# Altium project MiniRobot.PrjPcb
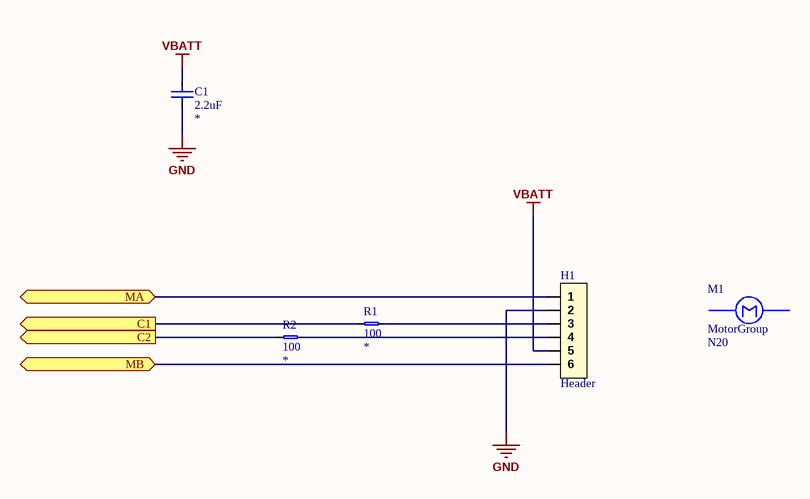
[diagram p0: MR_Motor.SchDoc]
5 sheets, 29 parts. Net scope: flat (ports and power ports of the same name join across sheets).
Board file: MiniRobot.PcbDoc
Sheets:
  MR_Motor.SchDoc
  MR_Motor_Control.SchDoc
  MR_Power.SchDoc
  MR_RangeSensor.SchDoc
  MR_UartConnector.SchDoc

## Sheet MR_Motor.SchDoc
size A4; CompanyName: BeeIonic; SheetNumber: 2; SheetTotal: 7

### Parts
(Parts that share a designator on the sheet are numbered #1, #2 ... from top to bottom, then left to right.)
C1  value 2.2uF  [0603_CAP_LD]  (hidden comment: CerCap)
H1  Header  [HEADER_1X6_PICOBLADE_653106124022]
M1#1  MotorGroup  Reference: N20  [MotorGroup]
R1  value 100  [0603_RES_LD]  (hidden comment: Resistor)
R2  value 100  [0603_RES_LD]  (hidden comment: Resistor)

### Ports
C1 (out), C2 (out), MA (bidir), MB (bidir)

### Nets
GND: C1.1 H1.2
VBATT: C1.2 H1.5
NetH1_1: H1.1 ; port MA
NetH1_3: H1.3 R1.2
NetH1_4: H1.4 R2.2
NetH1_6: H1.6 ; port MB
NetR1_1: R1.1 ; port C1
NetR2_1: R2.1 ; port C2

### Notes on the sheet
- Project :
- Title :
- Sheet:
- of
- Creation Date :
- Designer :
- Modified Date :

### Library data of the parts
C1 = CerCap: Ceramic Capacitor; Type: *; Voltage/Power: *; Package: *
H1 = Header_6x1: Header 6x1 Pins
M1#1 = Motor
R1 R2 = Resistor: Precision: *; Package: *

## Sheet MR_Motor_Control.SchDoc
size A4; CompanyName: BeeIonic; SheetNumber: 3; SheetTotal: 7
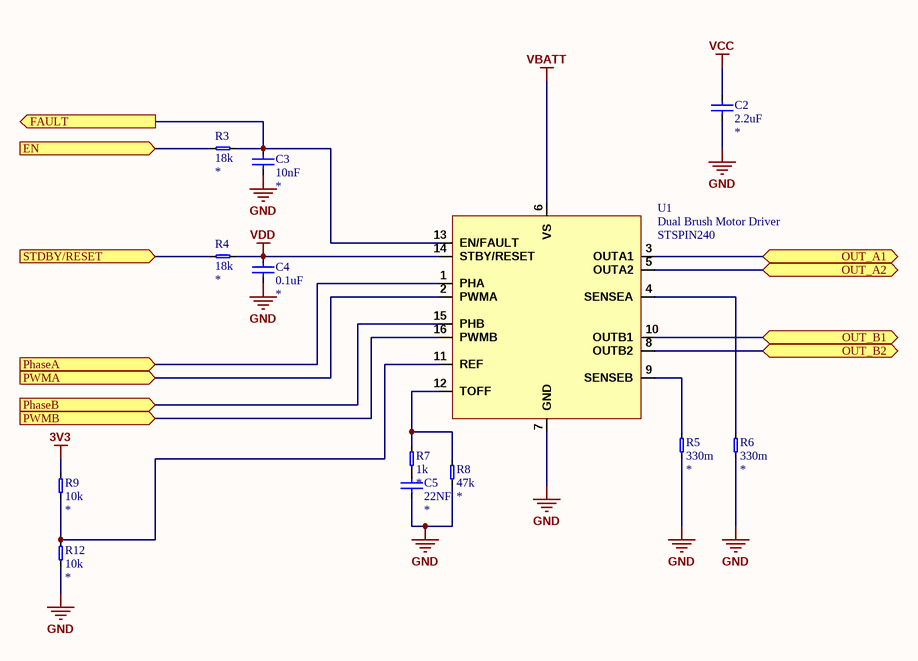
[diagram p1: MR_Motor_Control.SchDoc]

### Parts
C2  value 2.2uF  [0603_CAP_LD]  (hidden comment: CerCap)
C3  value 10nF  [0603_CAP_LD]  (hidden comment: CerCap)
C4  value 0.1uF  [0603_CAP_LD]  (hidden comment: CerCap)
C5  value 22NF  [0603_CAP_LD]  (hidden comment: CerCap)
R3  value 18k  [0603_RES_LD]  (hidden comment: Resistor)
R4  value 18k  [0603_RES_LD]  (hidden comment: Resistor)
R5  value 330m  [2512_RES_LD]  (hidden comment: Resistor)
R6  value 330m  [2512_RES_LD]  (hidden comment: Resistor)
R7  value 1k  [0603_RES_LD]  (hidden comment: Resistor)
R8  value 47k  [0603_RES_LD]  (hidden comment: Resistor)
R9  value 10k  [0603_RES_LD]  (hidden comment: Resistor)
R12  value 10k  [0603_RES_LD]  (hidden comment: Resistor)
U1  Dual Brush Motor Driver  [QFN-STSPIN240]

### Ports
EN (in), FAULT (out), OUT_A1 (bidir), OUT_A2 (bidir), OUT_B1 (bidir), OUT_B2 (bidir), PhaseA (in), PhaseB (in), PWMA (in), PWMB (in), STDBY/RESET (in)

### Nets
3V3: R9.2
GND: C2.1 C3.2 C4.2 C5.1 R5.1 R6.1 R8.1 R12.1 U1.7(GND)
VBATT: U1.6(VS)
VCC: C2.2
VDD: C4.1 R4.1 U1.14(STBY/RESET)
NetC3_1: C3.1 R3.2 U1.13(EN/FAULT) ; port FAULT
NetC5_2: C5.2 R7.1
NetR3_1: R3.1 ; port EN
NetR4_2: R4.2 ; port STDBY/RESET
NetR5_2: R5.2 U1.9(SENSEB)
NetR6_2: R6.2 U1.4(SENSEA)
NetR7_2: R7.2 R8.2 U1.12(TOFF)
NetR9_1: R9.1 R12.2 U1.11(REF)
NetU1_1: U1.1(PHA) ; port PhaseA
NetU1_2: U1.2(PWMA) ; port PWMA
NetU1_3: U1.3(OUTA1) ; port OUT_A1
NetU1_5: U1.5(OUTA2) ; port OUT_A2
NetU1_8: U1.8(OUTB2) ; port OUT_B2
NetU1_10: U1.10(OUTB1) ; port OUT_B1
NetU1_15: U1.15(PHB) ; port PhaseB
NetU1_16: U1.16(PWMB) ; port PWMB

### Notes on the sheet
- Project :
- Title :
- Sheet:
- of
- Creation Date :
- Designer :
- Modified Date :

### Library data of the parts
C2-C5 = CerCap: Ceramic Capacitor; Type: *; Voltage/Power: *; Package: *
U1 = STSPIN240: ST Dual Motor Driver; Reference: STSPIN240
R3-R9 R12 = Resistor: Precision: *; Package: *

## Sheet MR_Power.SchDoc
size A4; CompanyName: BeeIonic; SheetNumber: 5; SheetTotal: 7
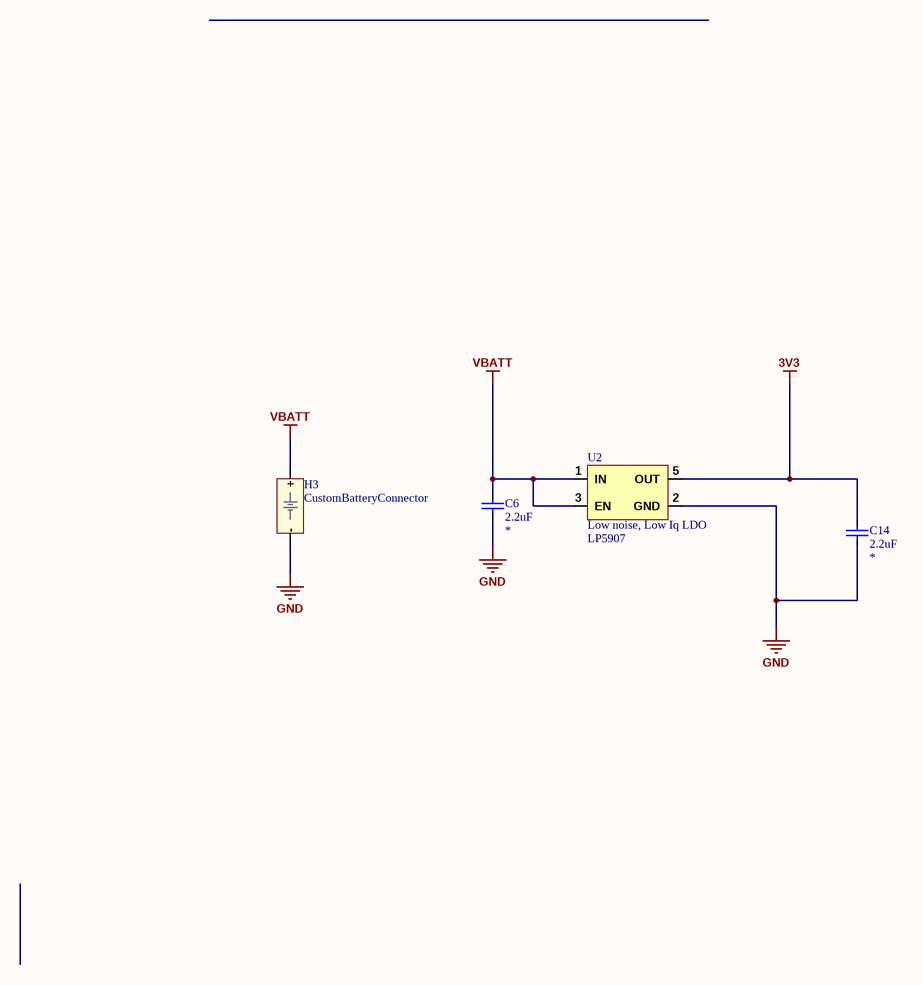
[diagram p2: MR_Power.SchDoc]

### Parts
C6  value 2.2uF  [0603_CAP_LD]  (hidden comment: CerCap)
C14  value 2.2uF  [0603_CAP_LD]  (hidden comment: CerCap)
H3  CustomBatteryConnector  [CustomBatteryConnector]
U2  Low noise, Low Iq LDO  [LP5907]

### Nets
3V3: C14.2 U2.5(OUT)
GND: C6.1 C14.1 H3.- U2.2(GND)
VBATT: C6.2 H3.+ U2.1(IN) U2.3(EN)

Not connected (* = marked no-connect by the designer): U2 4(NC)

### Notes on the sheet
- Project :
- Title :
- Sheet:
- of
- Creation Date :
- Designer :
- Modified Date :

### Library data of the parts
C6 C14 = CerCap: Ceramic Capacitor; Type: *; Voltage/Power: *; Package: *
H3 = BatteryConnector: Custom Battery Connector
U2 = LP5907: LP5907 Low Noise Low Iq LDO; Reference: LP5907

## Sheet MR_RangeSensor.SchDoc
size A4; CompanyName: BeeIonic; SheetNumber: 6; SheetTotal: 7
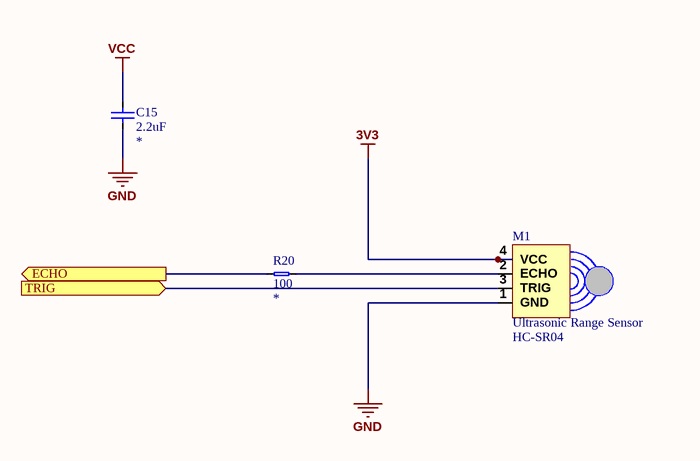
[diagram p3: MR_RangeSensor.SchDoc]

### Parts
(Parts that share a designator on the sheet are numbered #1, #2 ... from top to bottom, then left to right.)
C15  value 2.2uF  [0603_CAP_LD]  (hidden comment: CerCap)
M1#2  Ultrasonic Range Sensor  [HC-SR04]
R20  value 100  [0603_RES_LD]  (hidden comment: Resistor)

### Ports
ECHO (out), TRIG (in)

### Nets
3V3: M1#2.4(VCC)
GND: C15.2 M1#2.1(GND)
VCC: C15.1
NetM1#2_2: M1#2.2(ECHO) R20.2
NetM1#2_3: M1#2.3(TRIG) ; port TRIG
NetR20_1: R20.1 ; port ECHO

### Notes on the sheet
- Project :
- Title :
- Sheet:
- of
- Creation Date :
- Designer :
- Modified Date :

### Library data of the parts
C15 = CerCap: Ceramic Capacitor; Type: *; Voltage/Power: *; Package: *
M1#2 = HC-SR04: Reference: HC-SR04
R20 = Resistor: Precision: *; Package: *

## Sheet MR_UartConnector.SchDoc
size A4; CompanyName: BeeIonic; SheetNumber: 7; SheetTotal: 7
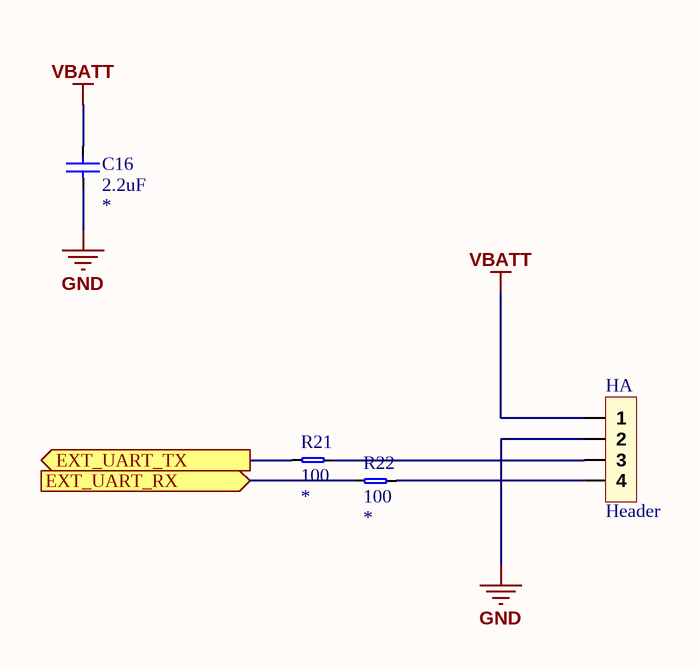
[diagram p4: MR_UartConnector.SchDoc]

### Parts
C16  value 2.2uF  [0603_CAP_LD]  (hidden comment: CerCap)
HA  Header  [HE14 1x4 Straight]
R21  value 100  [0603_RES_LD]  (hidden comment: Resistor)
R22  value 100  [0603_RES_LD]  (hidden comment: Resistor)

### Ports
EXT_UART_RX (in), EXT_UART_TX (out)

### Nets
GND: C16.1 HA.2
VBATT: C16.2 HA.1
NetHA_3: HA.3 R21.2
NetHA_4: HA.4 R22.2
NetR21_1: R21.1 ; port EXT_UART_TX
NetR22_1: R22.1 ; port EXT_UART_RX

### Notes on the sheet
- Project :
- Title :
- Sheet:
- of
- Creation Date :
- Designer :
- Modified Date :

### Library data of the parts
C16 = CerCap: Ceramic Capacitor; Type: *; Voltage/Power: *; Package: *
HA = Header_4x1: Header 4x1 PIns
R21 R22 = Resistor: Precision: *; Package: *

## Nets that join several sheets
3V3: MR_Motor_Control (R9.2), MR_Power (C14.2 U2.5), MR_RangeSensor (M1#2.4)
GND: MR_Motor (C1.1 H1.2), MR_Motor_Control (9 pins), MR_Power (C6.1 C14.1 H3.- U2.2), MR_RangeSensor (C15.2 M1#2.1), MR_UartConnector (C16.1 HA.2)
VBATT: MR_Motor (C1.2 H1.5), MR_Motor_Control (U1.6), MR_Power (C6.2 H3.+ U2.1 U2.3), MR_UartConnector (C16.2 HA.1)
VCC: MR_Motor_Control (C2.2), MR_RangeSensor (C15.1)